# Altium schematic sheet Micro.SchDoc: Microcontroller
size 419 x 296 mm; Author: James Bao; DocumentNumber: 1; SheetNumber: 2; SheetTotal: 4
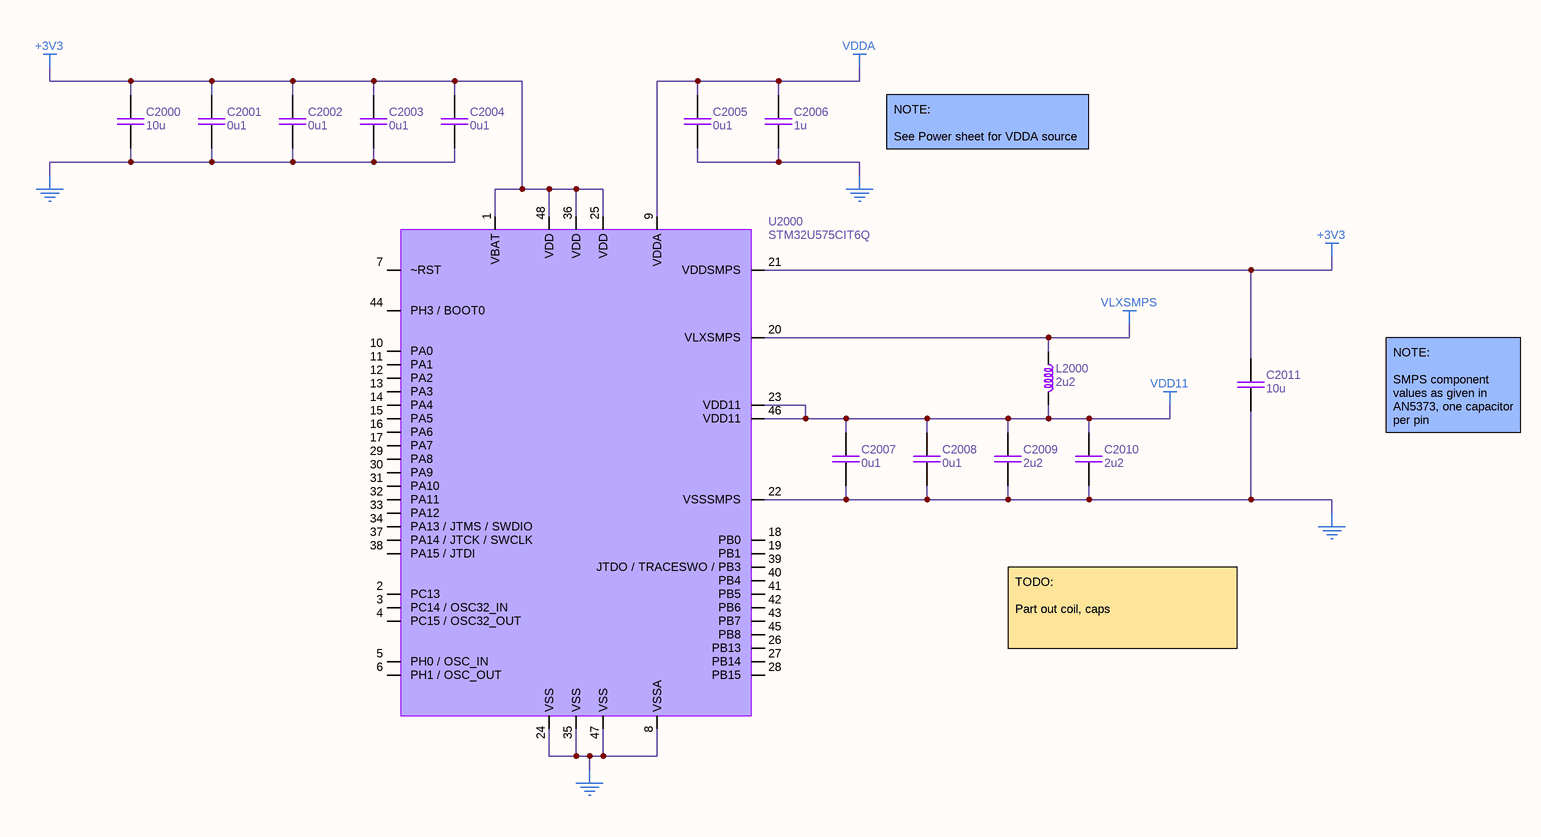
[diagram p0: Micro.SchDoc]

## Parts
C2000  10u  [CC1206KKX7R8BB106_SMT_1206]
C2001  0u1  [CC0402KRX7R7BB104_SMT_0402]
C2002  0u1  [CC0402KRX7R7BB104_SMT_0402]
C2003  0u1  [CC0402KRX7R7BB104_SMT_0402]
C2004  0u1  [CC0402KRX7R7BB104_SMT_0402]
C2005  0u1  [CC0402KRX7R7BB104_SMT_0402]
C2006  1u  [CC0603KRX7R7BB105_SMT_0603]
C2007  0u1  [CC0402KRX7R7BB104_SMT_0402]
C2008  0u1  [CC0402KRX7R7BB104_SMT_0402]
C2009  2u2  [CC0402KRX7R7BB104_SMT_0402]
C2010  2u2  [CC0402KRX7R7BB104_SMT_0402]
C2011  10u  [CC1206KKX7R8BB106_SMT_1206]
L2000  2u2
U2000  STM32U575CIT6Q  [STM32U575CIT6Q_SMT_48-LQFP]

## Nets
+3V3: C2000.2 C2001.2 C2002.2 C2003.2 C2004.2 C2011.2 U2000.1(VBAT) U2000.21(VDDSMPS) U2000.25(VDD) U2000.36(VDD) U2000.48(VDD)
GND: C2000.1 C2001.1 C2002.1 C2003.1 C2004.1 C2005.1 C2006.1 C2007.1 C2008.1 C2009.1 C2010.1 C2011.1 U2000.8(VSSA) U2000.22(VSSSMPS) U2000.24(VSS) U2000.35(VSS) U2000.47(VSS)
VDD11: C2007.2 C2008.2 C2009.2 C2010.2 L2000.2 U2000.23(VDD11) U2000.46(VDD11)
VDDA: C2005.2 C2006.2 U2000.9(VDDA)
VLXSMPS: L2000.1 U2000.20(VLXSMPS)

Not connected (* = marked no-connect by the designer): U2000 2(PC13) 3(PC14_/_OSC32_IN) 4(PC15_/_OSC32_OUT) 5(PH0_/_OSC_IN) 6(PH1_/_OSC_OUT) 7(~RST) 10(PA0) 11(PA1) 12(PA2) 13(PA3) 14(PA4) 15(PA5) 16(PA6) 17(PA7) 18(PB0) 19(PB1) 26(PB13) 27(PB14) 28(PB15) 29(PA8) 30(PA9) 31(PA10) 32(PA11) 33(PA12) 34(PA13_/_JTMS_/_SWDIO) 37(PA14_/_JTCK_/_SWCLK) 38(PA15_/_JTDI) 39(JTDO_/_TRACESWO_/_PB3) 40(PB4) 41(PB5) 42(PB6) 43(PB7) 44(PH3_/_BOOT0) 45(PB8)

## Notes on the sheet
- NOTE:
  See Power sheet for VDDA source
- NOTE:
  SMPS component values as given in AN5373, one capacitor per pin
- TODO:
  Part out coil, caps
- Project
- algovision
- Document
- Project Revision
- Date
- Time
- Document Revision
- Sheet
- of
- Revision
- File

## Library data of the parts
C2000 C2011 = CC1206KKX7R8BB106_SMT_1206: 1206 SMT 10u 25V X7R ceramic capacitor; Manufacturer: YAGEO; Manufacturer Part Number: CC1206KKX7R8BB106; Supplier: DigiKey; Supplier Part Number: 311-1959; Package: 1206; Height (Max): 1.8; ComponentLink1Description: Datasheet; ComponentLink1URL: https://www.yageo.com/upload/media/product/productsearch/datasheet/mlcc/UPY-GPHC_X7R_6.3V-to-250V_23.pdf; ComponentLink2Description: Supplier Link; ComponentLink2URL: https://www.digikey.co.nz/en/products/detail/yageo/CC1206KKX7R8BB106/5195365
C2001-C2005 C2007-C2010 = CC0402KRX7R7BB104_SMT_0402: 0402 SMT 0u1 16V X7R ceramic capacitor; Manufacturer: YAGEO; Manufacturer Part Number: CC0402KRX7R7BB104; Supplier: DigiKey; Supplier Part Number: 311-1338; Package: 0402; Height (Max): 0.55; ComponentLink1Description: Datasheet; ComponentLink1URL: https://www.yageo.com/upload/media/product/productsearch/datasheet/mlcc/UPY-GPHC_X7R_6.3V-to-250V_23.pdf; ComponentLink2Description: Supplier Link; ComponentLink2URL: https://www.digikey.co.nz/en/products/detail/yageo/CC0402KRX7R7BB104/2103076
C2006 = CC0603KRX7R7BB105_SMT_0603: 0603 SMT 1u 16V X7R ceramic capacitor; Manufacturer: YAGEO; Manufacturer Part Number: CC0603KRX7R7BB105; Supplier: DigiKey; Supplier Part Number: 311-1446; Package: 0603; Height (Max): 0.9; ComponentLink1Description: Datasheet; ComponentLink1URL: https://www.yageo.com/upload/media/product/productsearch/datasheet/mlcc/UPY-GPHC_X7R_6.3V-to-250V_23.pdf; ComponentLink2Description: Supplier Link; ComponentLink2URL: https://www.digikey.co.nz/en/products/detail/yageo/CC0603KRX7R7BB105/2833611
L2000 = INDUCTOR: TODO INDUCTOR
U2000 = STM32U575CIT6Q_SMT_48-LQFP: 48-LQFP SMT STM32U5 32-bit ARM Cortex-M33 microcontroller; Manufacturer: STMicroelectronics; ComponentLink1Description: Datasheet; ComponentLink1URL: https://www.st.com/resource/en/datasheet/stm32u575ag.pdf; ComponentLink2Description: Supplier Link; ComponentLink2URL: https://www.digikey.co.nz/en/products/detail/stmicroelectronics/STM32U575CIT6Q/18085454; Manufacturer Part Number: STM32U575CIT6Q; Supplier: DigiKey; Supplier Part Number: 497-STM32U575CIT6Q-ND; Package: 48-LQFP; Height (Max): 1.6